# Altium schematic sheet DistribPower_PWR.SchDoc: Плата раздачи электропитания
size 594 x 420 mm; ApprovedBy: Иванов; CheckedBy: Вакулин; DrawnBy: Подлесный; DocumentNumber: РД-11.02.00 Э3; SheetNumber: 1; SheetTotal: 3; Format: A2; DocumentType: Схема электрическая принципиальная; Title1str: передней части; ImagePath: Введите номер платы
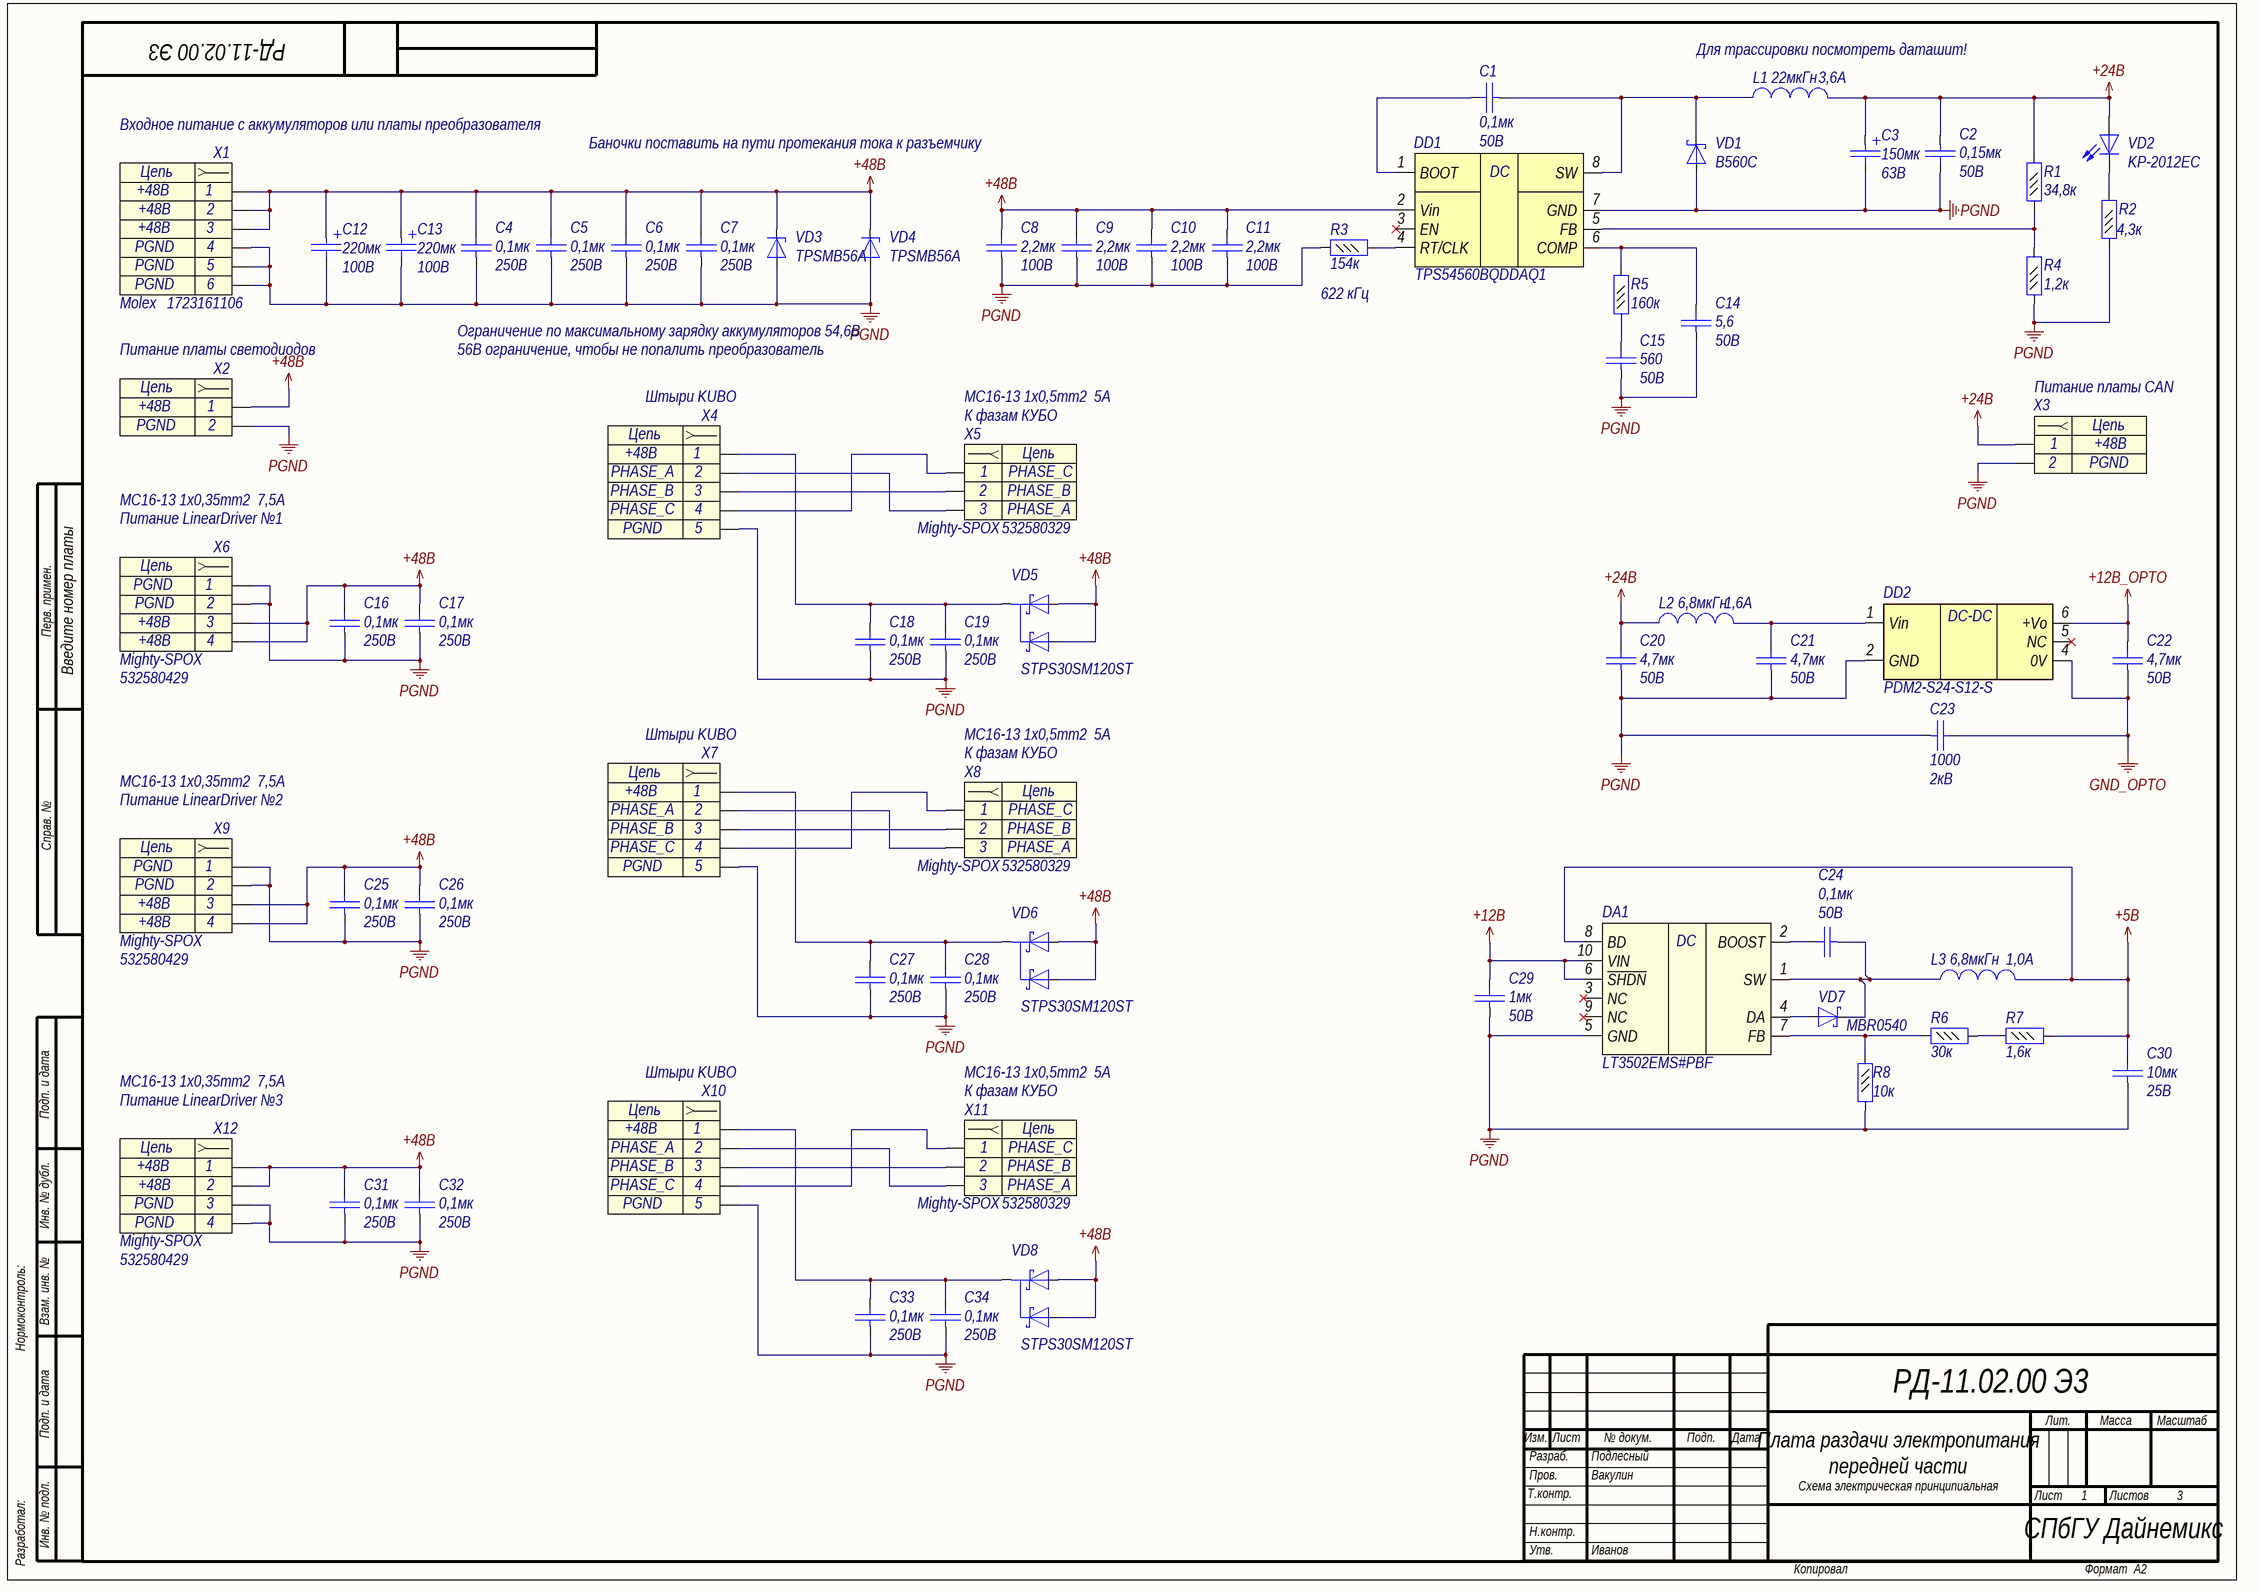
[diagram p0: DistribPower_PWR.SchDoc]

## Parts
C1  Voltage: 50В  [C0402]  (hidden comment: 0,1мк)
C2  Voltage: 50В  [C1812]  (hidden comment: 0,15мк)
C3  value 150мк  Voltage: 63B  [Cap_SMD_radial_polar(10x16.5)]  (hidden comment: Capacitor_pol)
C4  value 0,1мк  Voltage: 250В  [C1206]  (hidden comment: Capacitor)
C5  value 0,1мк  Voltage: 250В  [C1206]  (hidden comment: Capacitor)
C6  value 0,1мк  Voltage: 250В  [C1206]  (hidden comment: Capacitor)
C7  value 0,1мк  Voltage: 250В  [C1206]  (hidden comment: Capacitor)
C8  Voltage: 100В  [C1812]  (hidden comment: 2,2мк)
C9  Voltage: 100В  [C1812]  (hidden comment: 2,2мк)
C10  Voltage: 100В  [C1812]  (hidden comment: 2,2мк)
C11  Voltage: 100В  [C1812]  (hidden comment: 2,2мк)
C12  value 220мк  Voltage: 100B  [K50-35(12.5X25)_V]  (hidden comment: Capacitor_pol)
C13  value 220мк  Voltage: 100B  [K50-35(12.5X25)_V]  (hidden comment: Capacitor_pol)
C14  Voltage: 50B  [C0402]  (hidden comment: 5,6)
C15  Voltage: 50B  [C0402]  (hidden comment: 560)
C16  value 0,1мк  Voltage: 250В  [C1206]  (hidden comment: Capacitor)
C17  value 0,1мк  Voltage: 250В  [C1206]  (hidden comment: Capacitor)
C18  value 0,1мк  Voltage: 250В  [C1206]  (hidden comment: Capacitor)
C19  value 0,1мк  Voltage: 250В  [C1206]  (hidden comment: Capacitor)
C20  Voltage: 50В  [C1206]  (hidden comment: 4,7мк)
C21  Voltage: 50В  [C1206]  (hidden comment: 4,7мк)
C22  Voltage: 50В  [C1206]  (hidden comment: 4,7мк)
C23  Voltage: 2кB  [C1808]  (hidden comment: 1000)
C24  value 0,1мк  Voltage: 50В  [C0402]  (hidden comment: Capacitor)
C25  value 0,1мк  Voltage: 250В  [C1206]  (hidden comment: Capacitor)
C26  value 0,1мк  Voltage: 250В  [C1206]  (hidden comment: Capacitor)
C27  value 0,1мк  Voltage: 250В  [C1206]  (hidden comment: Capacitor)
C28  value 0,1мк  Voltage: 250В  [C1206]  (hidden comment: Capacitor)
C29  value 1мк  Voltage: 50B  [C0805]  (hidden comment: Capacitor)
C30  value 10мк  Voltage: 25В  [C1206]  (hidden comment: Capacitor)
C31  value 0,1мк  Voltage: 250В  [C1206]  (hidden comment: Capacitor)
C32  value 0,1мк  Voltage: 250В  [C1206]  (hidden comment: Capacitor)
C33  value 0,1мк  Voltage: 250В  [C1206]  (hidden comment: Capacitor)
C34  value 0,1мк  Voltage: 250В  [C1206]  (hidden comment: Capacitor)
DA1  Part Number: LT3502EMS#PBF  [MSOP10]  (hidden comment: LT3502_MS)
DD1  Part Number: TPS54560BQDDAQ1  [SO Powerpad8]  (hidden comment: TPS54560)
DD2  Part Number: PDM2-S24-S12-S  [SIP6]  (hidden comment: PDM2-Sxx-Sxx-S)
L1  value 22мкГн  Rated Current: 3,6A  [IND_12.5x12.5]  (hidden comment: Inductor)
L2  value 6,8мкГн  Rated Current: 1,6A  [SDR0604]  (hidden comment: Inductor)
L3  value 6,8мкГн  Rated Current: 1,0A  [SDR0302]  (hidden comment: Inductor)
R1  value 34,8к  [R0402]  (hidden comment: Resistor_0,062Вт)
R2  value 4,3к  [R0402]  (hidden comment: Resistor_0,062Вт)
R3  value 154к  [R0402]  (hidden comment: Resistor_0,062Вт)
R4  value 1,2к  [R0402]  (hidden comment: Resistor_0,062Вт)
R5  value 160к  [R0402]  (hidden comment: Resistor_0,062Вт)
R6  value 30к  [R0402]  (hidden comment: Resistor_0,062Вт)
R7  value 1,6к  [R0402]  (hidden comment: Resistor_0,062Вт)
R8  value 10к  [R0402]  (hidden comment: Resistor_0,062Вт)
VD1  Part Number: B560C  [SMC]  (hidden comment: DiodeSchottky)
VD2  Part Number: KP-2012EC  [L_0805]  (hidden comment: LED)
VD3  Part Number: TPSMB56A  [SMB]  (hidden comment: DiodeZener)
VD4  Part Number: TPSMB56A  [SMB]  (hidden comment: DiodeZener)
VD5  Part Number: STPS30SM120ST  [TO-220AB-3_RAD]  (hidden comment: DiodeSchottkyDual)
VD6  Part Number: STPS30SM120ST  [TO-220AB-3_RAD]  (hidden comment: DiodeSchottkyDual)
VD7  Part Number: MBR0540  [SOD-123]  (hidden comment: DiodeSchottky)
VD8  Part Number: STPS30SM120ST  [TO-220AB-3_RAD]  (hidden comment: DiodeSchottkyDual)
X1  Part Number: 1723161106  Manufacture: Molex  [MOLEX_1723161106]  (hidden comment: Header_6_sct)
X2  Питание платы светодиодов  [MOLEX_532580229]
X3  Питание платы CAN  [MOLEX_532580229]
X4  Штыри KUBO  [KUBO]
X5  К фазам КУБО  Part Name: Mighty-SPOX  Part Number: 532580329  [MOLEX_532580329]
X6  Питание LinearDriver №1  Part Name: Mighty-SPOX  Part Number: 532580429  [MOLEX_532580429]
X7  Штыри KUBO  [KUBO]
X8  К фазам КУБО  Part Name: Mighty-SPOX  Part Number: 532580329  [MOLEX_532580329]
X9  Питание LinearDriver №2  Part Name: Mighty-SPOX  Part Number: 532580429  [MOLEX_532580429]
X10  Штыри KUBO  [KUBO]
X11  К фазам КУБО  Part Name: Mighty-SPOX  Part Number: 532580329  [MOLEX_532580329]
X12  Питание LinearDriver №3  Part Name: Mighty-SPOX  Part Number: 532580429  [MOLEX_532580429]

## Nets
+5B: C30.2 DA1.8(BD) L3.2 R7.2
+12B: C29.2 DA1.6(~{SHDN}) DA1.10(VIN)
+12B_OPTO: C22.2 DD2.6(+Vo)
+24B: C2.1 C3.1 C20.2 L1.2 L2.1 R1.2 VD2.2(A) X3.1
+48B: C4.2 C5.2 C6.2 C7.2 C8.2 C9.2 C10.2 C11.2 C12.1 C13.1 C16.2 C17.2 C25.2 C26.2 C31.2 C32.2 DD1.2(Vin) VD3.1(K) VD4.1(K) VD5.1(A) VD5.3(A) VD6.1(A) VD6.3(A) VD8.1(A) VD8.3(A) X1.1 X1.2 X1.3 X2.1 X6.3 X6.4 X9.3 X9.4 X12.1 X12.2
GND_OPTO: C22.1 C23.2 DD2.4(0V)
PGND: C2.2 C3.2 C4.1 C5.1 C6.1 C7.1 C8.1 C9.1 C10.1 C11.1 C12.2 C13.2 C14.1 C15.1 C16.1 C17.1 C18.1 C19.1 C20.1 C21.1 C23.1 C25.1 C26.1 C27.1 C28.1 C29.1 C30.1 C31.1 C32.1 C33.1 C34.1 DA1.5(GND) DD1.7(GND) DD2.2(GND) R2.1 R3.1 R4.1 R8.2 VD1.2(A) VD3.2(A) VD4.2(A) X1.4 X1.5 X1.6 X2.2 X3.2 X4.5 X6.1 X6.2 X7.5 X9.1 X9.2 X10.5 X12.3 X12.4
NetC1_1: C1.1 DD1.8(SW) L1.1 VD1.1(K)
NetC1_2: C1.2 DD1.1(BOOT)
NetC14_2: C14.2 DD1.6(COMP) R5.2
NetC15_2: C15.2 R5.1
NetC18_2: C18.2 C19.2 VD5.2(K) X4.1
NetC21_2: C21.2 DD2.1(Vin) L2.2
NetC24_1: C24.1 DA1.1(SW) L3.1 VD7.1(K)
NetC24_2: C24.2 DA1.2(BOOST)
NetC27_2: C27.2 C28.2 VD6.2(K) X7.1
NetC33_2: C33.2 C34.2 VD8.2(K) X10.1
NetDA1_4: DA1.4(DA) VD7.2(A)
NetDA1_7: DA1.7(FB) R6.1 R8.1
NetDD1_4: DD1.4(RT/CLK) R3.2
NetDD1_5: DD1.5(FB) R1.1 R4.2
NetR2_2: R2.2 VD2.1(K)
NetR6_2: R6.2 R7.1
NetX4_2: X4.2 X5.3
NetX4_3: X4.3 X5.2
NetX4_4: X4.4 X5.1
NetX7_2: X7.2 X8.3
NetX7_3: X7.3 X8.2
NetX7_4: X7.4 X8.1
NetX10_2: X10.2 X11.3
NetX10_3: X10.3 X11.2
NetX10_4: X10.4 X11.1

Not connected (* = marked no-connect by the designer): DA1 3(NC)* 9(NC)*; DD1 3(EN)*; DD2 5(NC)*

## Notes on the sheet
- (near L1) Для трассировки посмотреть даташит!
- Входное питание с аккумуляторов или платы преобразователя
- Баночки поставить на пути протекания тока к разъемчику
- 622 кГц
- Ограничение по максимальному зарядку аккумуляторов 54,6В
- 56В ограничение, чтобы не попалить преобразователь
- МС16-13 1х0,5mm2  5А
- МС16-13 1х0,35mm2  7,5А
- Перв. примен.
- Справ. №
- Подп. и дата
- Инв. № дубл.
- Нормоконтроль:
- Взам. инв. №
- Изм.
- Лист
- № докум.
- Подп.
- Дата
- Лит.
- Масса
- Масштаб
- Т.контр.
- Пров.
- Разраб.
- Листов
- Разработал:
- Инв. № подл.
- Н.контр.
- СПбГУ Дайнемикс
- Утв.
- Копировал
- Формат
- (in symbol connect104) Цепь
- (in symbol connect105) Цепь
- (in symbol connect121) Цепь
- (in symbol connect134) Цепь
- (in symbol connect137) Цепь
- (in symbol pwr112) DC
- (in symbol pwr127) DC
- (in symbol pwr128) DC-DC

## Library data of the parts
C1 C24 = cap277: Конденсатор; Part Name: Ceramic; Manufacture: Murata; Part Number: GRM155R71H104KE14D; id: cap277; TKE: X7R; tga: 0,10%
  C1: Value: 0,1мк
C2 = cap285: Конденсатор; Part Name: Ceramic; Manufacture: TDK; Part Number: C4532C0G1H154J250KA; id: cap285; TKE: NP0; Value: 0,15мк
C3 = cap296: Конденсатор полярный; Part Name: Electrolit Polimer; Manufacture: Panasonic; Part Number: EEH-ZS1J151P; id: cap296; tga: 0,20%; ESR: 15мОм; Iac rated: 3,5А
C4-C7 C16-C19 C25-C28 C31-C34 = cap179: Конденсатор; Part Name: Ceramic; Manufacture: Murata; Part Number: GRM31CR72E104K; id: cap179; TKE: X7R
C8-C11 = cap293: Конденсатор; Part Name: MLCC; Manufacture: TDK; Part Number: C4532X7R2A225M; id: cap293; TKE: X7R; tga: 0,10%; Value: 2,2мк
C12 C13 = cap279: Конденсатор полярный; Part Name: Electrolit; Manufacture: Epcos; Part Number: B41851A9227M000; id: cap279; tga: 0,10%; ESR: 75мОм; Iac max: 0,4А; Iac rated: 0,6А
C14 = cap4: Конденсатор; Part Name: Ceramic; Manufacture: Murata; Part Number: GRM1555C1H5R6C; id: cap4; TKE: NP0; Value: 5,6
C15 = cap25: Конденсатор; Part Name: Ceramic; Manufacture: Murata; Part Number: GRM1555C1H561J; id: cap25; TKE: NP0; Value: 560
C20-C22 = cap188: Конденсатор; Part Name: Ceramic; Manufacture: Murata; Part Number: GRM31CR71H475KA12L; id: cap188; TKE: X7R; Value: 4,7мк
C23 = cap266: Конденсатор; Part Name: Ceramic; Manufacture: Murata; Part Number: GR442QR73D102KW01L; id: cap266; TKE: X7R; tga: 0,10%; Value: 1000
C29 = cap151: Конденсатор; Part Name: Ceramic; Manufacture: Murata; Part Number: GRM21BR71H105K; id: cap151; TKE: X7R
C30 = cap186: Конденсатор; Part Name: Ceramic; Manufacture: Murata; Part Number: GRM31CR71E106KA12L*; id: cap186; TKE: X7R
DA1 = pwr112: 1.1MHz/2.2MHz, 500mA  Step-Down Regulators; Part Name: 1-A synchronous buck DC/DC converter with ultra-low IQ; Manufacturer: Linear Technology; id: pwr112; Input Voltage: 40B; Output Voltage: Adj; Current: 0,5А; Frequency: 2,2MHz; Type: Impulse
DD1 = pwr127: 5-A, Wide Input Range, Step-Down Converter; Part Name: Step Down DC-DC Converter with Eco-mode; Manufacturer: Texas Instruments; id: pwr127; Input Voltage: 4,5-60В; Output Voltage: 0,8B-58,8B; Current: 5A; Frequency: 100 kHz-25 MHz; Type: Impulse
DD2 = pwr128: DC/DC преобразователь изолированный; Part Name: DC/DC Converter Isolated; Manufacturer: CUI INC; id: pwr128; Input Voltage: 24B; Output Voltage: 12B; Current: 167mA; Power output: 2W; Type: Isolated
L1 = ind79: EMI Suppression Filter; Part Name: SMD Power Inductors; Part Number: B82477G4223M000; Manufacture: Epcos; id: ind79; Saturation Current: 4,25A; Resistance: 0,038Ohm
L2 = ind40: EMI Suppression Filter; Part Name: SMD Power Inductors; Part Number: SDR0604-6R8ML; Manufacture: Bourns; id: ind40; Saturation Current: 2,5A; Resistance: 0,12Ohm
L3 = ind186: EMI Suppression Filter; Part Name: SMD Power Inductors; Part Number: SDR0302-6R8ML; Manufacture: Bourns; id: ind186; Saturation Current: 1,2A; Resistance: 0,18Ohm; q-factor: 18; Temp MAX: 125; Temp MIN: -40
R1 = res1193: Резистор; Manufacture: Yageo; Part Number: RC0402FR-0734K8L; Accuracy: 0,01; id: res1193; Part Name: Resistor; Power: 0,062Вт
R2 = res285: Резистор; Manufacture: Yageo; Part Number: RC0402FR-074K3; id: res285; Accuracy: 0,01; Part Name: Resistor; Power: 0,062Вт
R3 = res1211: Резистор; Manufacture: Yageo; Part Number: RC0402FR-07154KL; Accuracy: 0,01; id: res1211; Part Name: Resistor; Power: 0,062Вт
R4 = res272: Резистор; Manufacture: Yageo; Part Number: RC0402FR-071K2; id: res272; Accuracy: 0,01; Part Name: Resistor; Power: 0,062Вт
R5 = res323: Резистор; Manufacture: Yageo; Part Number: RC0402FR-07160KL; id: res323; Accuracy: 0,01; Part Name: Resistor; Power: 0,062Вт
R6 = res305: Резистор; Manufacture: Yageo; Part Number: RC0402FR-0730KL; id: res305; Accuracy: 0,01; Part Name: Resistor; Power: 0,062Вт
R7 = res275: Резистор; Manufacture: Yageo; Part Number: RC0402FR-071K6; id: res275; Accuracy: 0,01; Part Name: Resistor; Power: 0,062Вт
R8 = res294: Резистор; Manufacture: Yageo; Part Number: RC0402FR-0710KL; id: res294; Accuracy: 0,01; Part Name: Resistor; Power: 0,062Вт
VD1 = diode32: Диод Шоттки; Part Name: SCHOTTKY BARRIER RECTIFIER; Manufacture: Diodes Incorporated; Max Reverse Voltage: 60B; Forward Voltage: 0,7B; Forward Current: 5A; Leakage current: 20mA; Capacitance: 300pF; Number of Channels: 1; id: diode32; Breakdown Voltage: 60B; Temp MAX: +150; Temp MIN: -55
VD2 = diode5: Светодиод; id: diode5; Part Name: LED
VD3 VD4 = TPSMB56A: Cтабилитрон (лавинный выпрямительный диод) односторонний; Part Name: TVS diode Unidirectional; Manufacture: Littelfuse; id: tvs285; Leakage Current: 8uA; Stand-off Voltage: 56B; Breakdown Voltage: 58,8B; Clamping voltage: 77B; Peak Pulse Power: 600W; Number of diodes: 1
VD5 VD6 VD8 = diode39: Диод Шоттки; Part Name: power Schottky rectifier; Manufacture: ST Microelectronics; Max Reverse Voltage: 120B; Forward Voltage: 0,47B; Forward Current: 30A; Leakage current: 275uA; Power Dissipation: 1200W peak; Number of Channels: 2; id: diode39; Breakdown Voltage: 120B; Temp MAX: +175; Temp MIN: -65
VD7 = diode15: Диод Шоттки; Manufacture: ON Semiconductor; Max Reverse Voltage: 40B; Forward Voltage: 0,62B; Forward Current: 0,5А; Capacitance: 30pF; Number of Channels: 1; id: diode15; Part Name: Diode Schottky
X1 = connect137: Разъем - 6 конт. розетка; Part Name: Ultra-Fit Horizontal Header; Contact_1: +48B; Contact_4: PGND; Etch: 3.5mm; Contact_2: +48B; Contact_3: +48B; Contact_5: PGND; Contact_6: PGND; id: connect137
X2 X3 = connect105: Разъем - 2 конт. розетка; Part Name: Mighty-SPOX; Part Number: 532580229; Manufacture: Molex; Contact_1: +48B; Contact_2: PGND; Etch: 3.5mm; id: connect105
X4 X7 X10 = connect134: Разъем - 5 конт. розетка; Part Name: KUBO Technologies; Contact_1: +48B; Contact_2: PHASE_A; Contact_3: PHASE_B; Contact_4: PHASE_C; Contact_5: PGND; Etch: 3.6mm; id: connect134
X5 = connect104: Разъем - 3 конт. розетка; Manufacture: Molex; Contact_1: PHASE_С; Contact_2: PHASE_B; Contact_3: PHASE_A; Etch: 3.5mm; id: connect104
X6 X9 = connect121: Разъем - 4 конт. розетка; Manufacture: Molex; Contact_1: PGND; Contact_3: +48B; Etch: 3.5mm; Contact_2: PGND; Contact_4: +48B; id: connect121
X8 X11 = connect104: Разъем - 3 конт. розетка; Manufacture: Molex; Contact_1: PHASE_C; Contact_2: PHASE_B; Contact_3: PHASE_A; Etch: 3.5mm; id: connect104
X12 = connect121: Разъем - 4 конт. розетка; Manufacture: Molex; Contact_1: +48B; Contact_3: PGND; Etch: 3.5mm; Contact_2: +48B; Contact_4: PGND; id: connect121